# Altium schematic sheet S03-TRANSCEIVER.SchDoc
size B; SheetNumber: 4; SheetTotal: 4; BLOCK-TITLE: BLUETOOTH RADIO TRANSCEIVER; BLOCK-SIZE: B; BLOCK-PROJECT: MULTIMOD RADIO MODULE; BLOCK-REVISION: 1; BLOCK-ORGANIZATION: UNIVERSITY OF FLORIDA; BLOCK-DESIGNER: MEHRON TALEBI; BLOCK-IDENTIFIER: SUMMER 2023; BLOCK-REVIEWER: MIKE STAPLETON
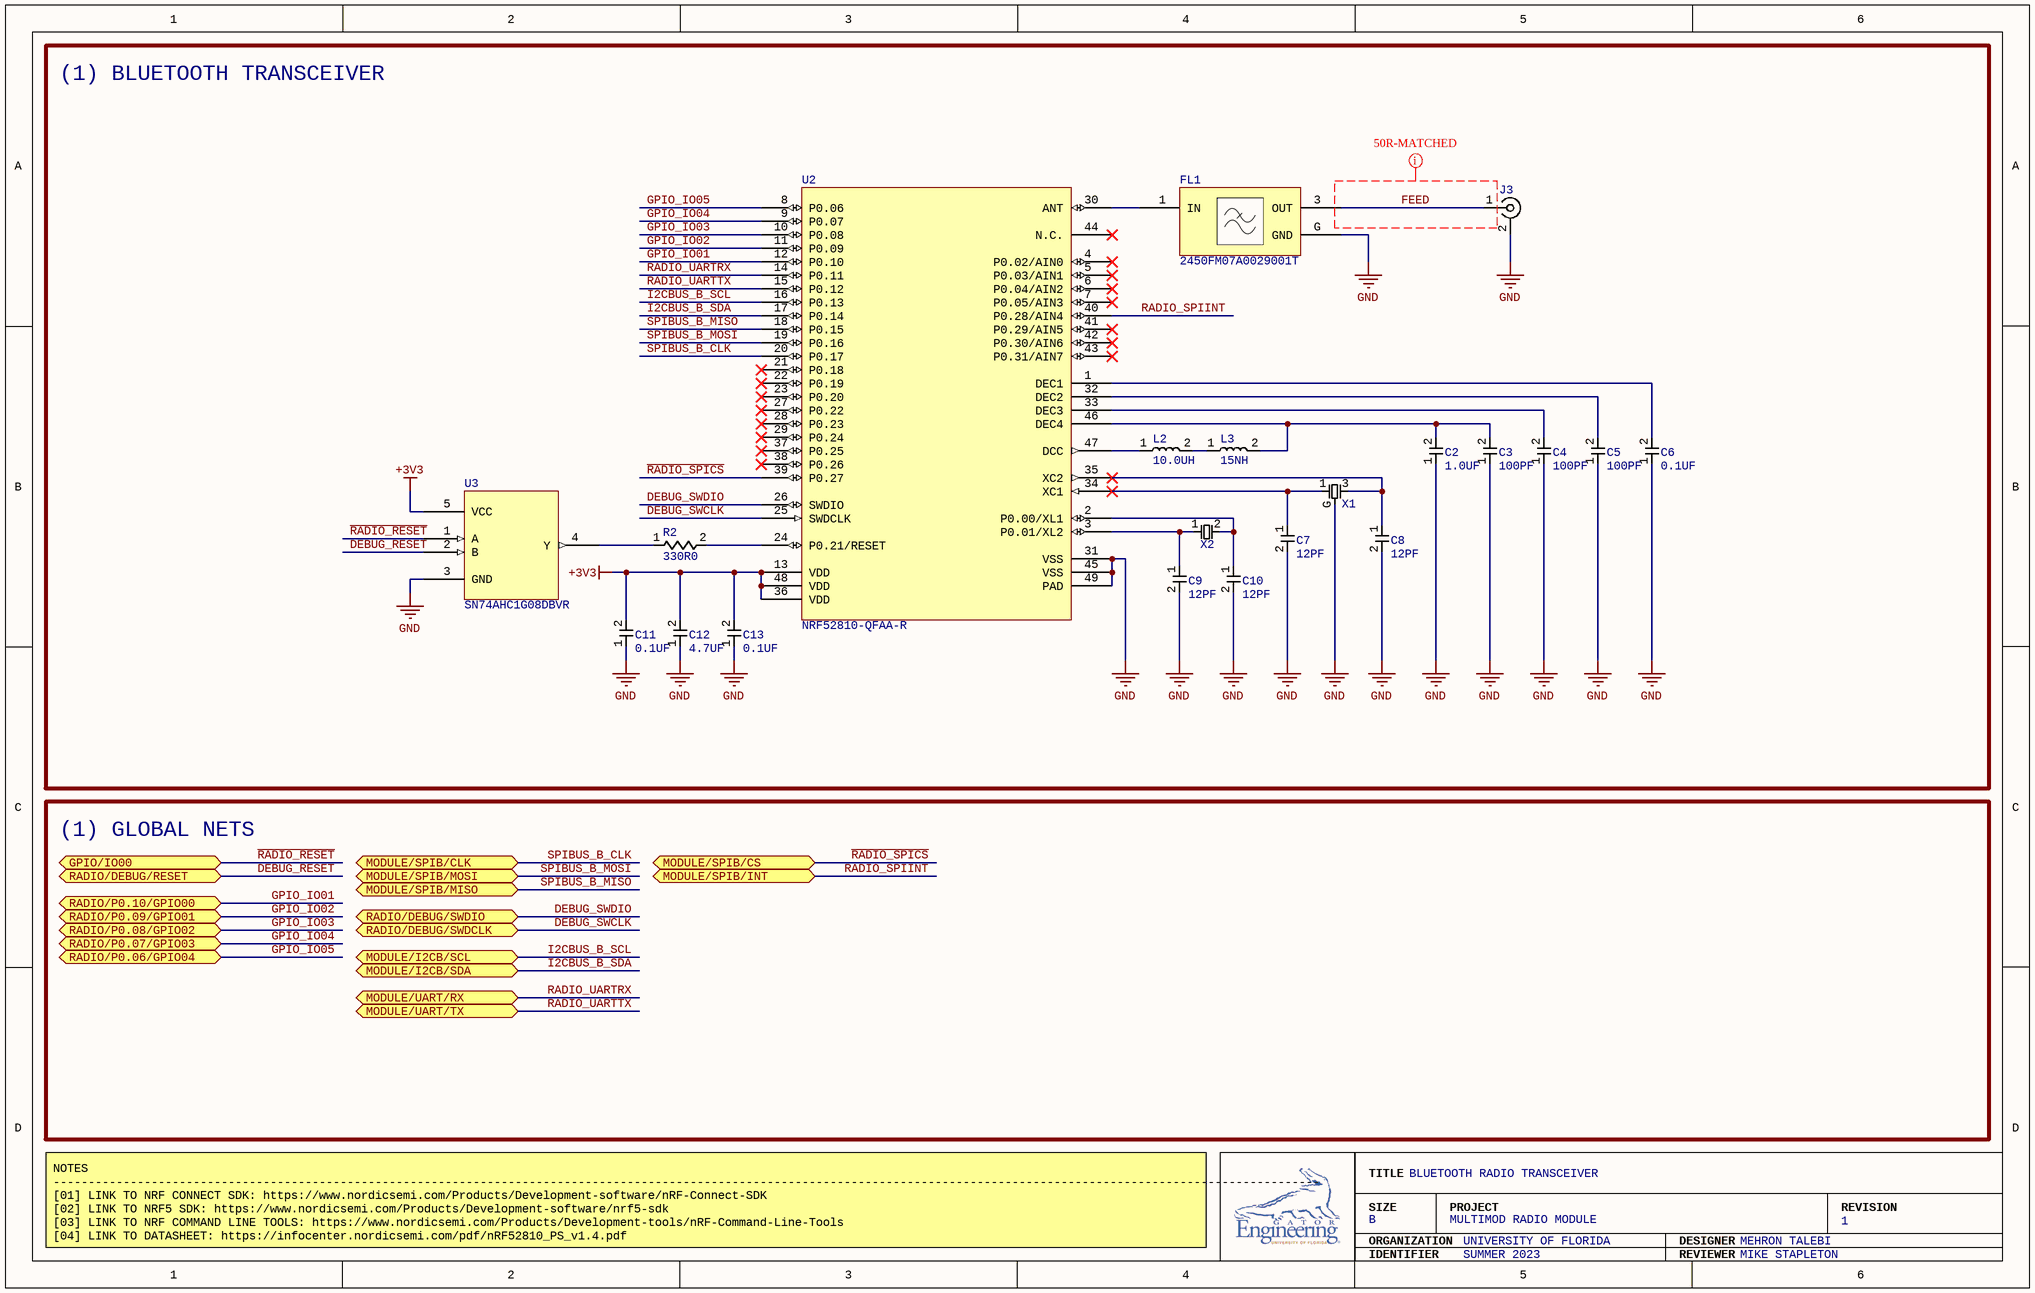
[diagram p0: S03-TRANSCEIVER.SchDoc]

## Parts
C2  1.0UF  [GCM188R71E105KA64D]
C3  100PF  [GCM1555C1H101JA16D]
C4  100PF  [GCM1555C1H101JA16D]
C5  100PF  [GCM1555C1H101JA16D]
C6  0.1UF  [GRM155R71H104KE14D]
C7  12PF  [GJM1555C1H120GB01D]
C8  12PF  [GJM1555C1H120GB01D]
C9  12PF  [GJM1555C1H120GB01D]
C10  12PF  [GJM1555C1H120GB01D]
C11  0.1UF  [GRM155R71H104KE14D]
C12  4.7UF  [GRM188R61E475KE11D]
C13  0.1UF  [GRM155R71H104KE14D]
FL1  2450FM07A0029001T  [2450FM07A0029001T]
J3  2337019-1  [2337019-1]  (value not drawn)
L2  10.0UH  [LQM18FN100M00D]
L3  15NH  [0402HS-150EKTS]
R2  330R0  [RC0805FR-7W330RL]
U2  NRF52810-QFAA-R  [NRF52810-QFAA-R]
U3  SN74AHC1G08DBVR  [SN74AHC1G08DBVR]
X1  32.0000MHZ  [ECS-320-8-37CKM]  (value not drawn)
X2  32.7680KHZ  [ECS-327-9-34QS-TR]  (value not drawn)

## Blocks framed on the sheet
(1) BLUETOOTH TRANSCEIVER: C2-C13 FL1 J3 L2 L3 R2 U2 U3 X1 X2

## Ports
GPIO/IO00 (bidir), MODULE/I2CB/SCL (bidir), MODULE/I2CB/SDA (bidir), MODULE/SPIB/CLK (bidir), MODULE/SPIB/CS (bidir), MODULE/SPIB/INT (bidir), MODULE/SPIB/MISO (bidir), MODULE/SPIB/MOSI (bidir), MODULE/UART/RX (bidir), MODULE/UART/TX (bidir), RADIO/DEBUG/RESET (bidir), RADIO/DEBUG/SWDCLK (bidir), RADIO/DEBUG/SWDIO (bidir), RADIO/P0.06/GPIO04 (bidir), RADIO/P0.07/GPIO03 (bidir), RADIO/P0.08/GPIO02 (bidir), RADIO/P0.09/GPIO01 (bidir), RADIO/P0.10/GPIO00 (bidir)

## Nets
+3V3: C11.2 C12.2 C13.2 U2.13(VDD) U2.36(VDD) U2.48(VDD) U3.5(VCC)
GND: C2.1 C3.1 C4.1 C5.1 C6.1 C7.2 C8.2 C9.2 C10.2 C11.1 C12.1 C13.1 FL1.G(GND) J3.2(GND) U2.31(VSS) U2.45(VSS) U2.49(PAD) U3.3(GND) X1.G
~{DEBUG_RESET}: U3.2(B) ; port RADIO/DEBUG/RESET
~{RADIO_RESET}: U3.1(A) ; port GPIO/IO00
~{RADIO_SPICS}: U2.39(P0.27) ; port MODULE/SPIB/CS
DEBUG_SWCLK: U2.25(SWDCLK) ; port RADIO/DEBUG/SWDCLK
DEBUG_SWDIO: U2.26(SWDIO) ; port RADIO/DEBUG/SWDIO
FEED: FL1.3(OUT) J3.1(SIG)
GPIO_IO01: U2.12(P0.10) ; port RADIO/P0.10/GPIO00
GPIO_IO02: U2.11(P0.09) ; port RADIO/P0.09/GPIO01
GPIO_IO03: U2.10(P0.08) ; port RADIO/P0.08/GPIO02
GPIO_IO04: U2.9(P0.07) ; port RADIO/P0.07/GPIO03
GPIO_IO05: U2.8(P0.06) ; port RADIO/P0.06/GPIO04
I2CBUS_B_SCL: U2.16(P0.13) ; port MODULE/I2CB/SCL
I2CBUS_B_SDA: U2.17(P0.14) ; port MODULE/I2CB/SDA
RADIO_SPIINT: U2.40(P0.28/AIN4) ; port MODULE/SPIB/INT
RADIO_UARTRX: U2.14(P0.11) ; port MODULE/UART/RX
RADIO_UARTTX: U2.15(P0.12) ; port MODULE/UART/TX
SPIBUS_B_CLK: U2.20(P0.17) ; port MODULE/SPIB/CLK
SPIBUS_B_MISO: U2.18(P0.15) ; port MODULE/SPIB/MISO
SPIBUS_B_MOSI: U2.19(P0.16) ; port MODULE/SPIB/MOSI
NetC2_2: C2.2 C3.2 L3.2 U2.46(DEC4)
NetC4_2: C4.2 U2.33(DEC3)
NetC5_2: C5.2 U2.32(DEC2)
NetC6_2: C6.2 U2.1(DEC1)
NetC7_1: C7.1 U2.34(XC1) X1.1
NetC8_1: C8.1 U2.35(XC2) X1.3
NetC9_1: C9.1 U2.3(P0.01/XL2) X2.1
NetC10_1: C10.1 U2.2(P0.00/XL1) X2.2
NetFL1_1: FL1.1(IN) U2.30(ANT)
NetL2_1: L2.1 U2.47(DCC)
NetL2_2: L2.2 L3.1
NetR2_1: R2.1 U3.4(Y)
NetR2_2: R2.2 U2.24(P0.21/RESET)

Not connected (* = marked no-connect by the designer): U2 4(P0.02/AIN0)* 5(P0.03/AIN1)* 6(P0.04/AIN2)* 7(P0.05/AIN3)* 21(P0.18)* 22(P0.19)* 23(P0.20)* 27(P0.22)* 28(P0.23)* 29(P0.24)* 37(P0.25)* 38(P0.26)* 41(P0.29/AIN5)* 42(P0.30/AIN6)* 43(P0.31/AIN7)* 44(N.C.)*

## Layout directives
net class 50R-MATCHED: FEED

## Notes on the sheet
- (1) GLOBAL NETS
- NOTES
  -------------------------------------------------------------------------------------------------------------------------------------------------------------------------------------
  [01] LINK TO NRF CONNECT SDK: https://www.nordicsemi.com/Products/Development-software/nRF-Connect-SDK
  [02] LINK TO NRF5 SDK: https://www.nordicsemi.com/Products/Development-software/nrf5-sdk
  [03] LINK TO NRF COMMAND LINE TOOLS: https://www.nordicsemi.com/Products/Development-tools/nRF-Command-Line-Tools
  [04] LINK TO DATASHEET: https://infocenter.nordicsemi.com/pdf/nRF52810_PS_v1.4.pdf
- TITLE
- SIZE
- ORGANIZATION
- PROJECT
- DESIGNER
- REVISION
- IDENTIFIER
- REVIEWER

## Library data of the parts
C2 = GCM188R71E105KA64D: CAP CER 1UF 25V X7R 0603; Capacitance: 1 µF; Tolerance: ±10%; Voltage - Rated: 25V; Temperature Coefficient: X7R; Operating Temperature: -55°C ~ 125°C; Ratings: AEC-Q200; Applications: Automotive; Mounting Type: Surface Mount, MLCC; Package / Case: 0603 (1608 Metric); Size / Dimension: 0.063" L x 0.031" W (1.60mm x 0.80mm); Thickness (Max): 0.035" (0.90mm); Supplier 1: Arrow Electronics; Supplier Part Number 1: GCM188R71E105KA64D
C3-C5 = GCM1555C1H101JA16D: CAP CER 100PF 50V C0G/NP0 0402; Tolerance: ±5%; Temperature Coefficient: C0G, NP0; Capacitance: 100 pF; Voltage - Rated: 50V; Operating Temperature: -55°C ~ 125°C; Ratings: AEC-Q200; Applications: Automotive; Mounting Type: Surface Mount, MLCC; Package / Case: 0402 (1005 Metric); Size / Dimension: 0.039" L x 0.020" W (1.00mm x 0.50mm); Thickness (Max): 0.022" (0.55mm); Supplier 1: Arrow Electronics; Supplier Part Number 1: GCM1555C1H101JA16D
C6 C11 C13 = GRM155R71H104KE14D: CAP CER 0.1UF 50V X7R 0402; Capacitance: 0.1 µF; Tolerance: ±10%; Voltage - Rated: 50V; Temperature Coefficient: X7R; Operating Temperature: -55°C ~ 125°C; Applications: General Purpose; Mounting Type: Surface Mount, MLCC; Package / Case: 0402 (1005 Metric); Size / Dimension: 0.039" L x 0.020" W (1.00mm x 0.50mm); Thickness (Max): 0.022" (0.55mm); Supplier 1: Arrow Electronics; Supplier Part Number 1: GRM155R71H104KE14D
C7-C10 = GJM1555C1H120GB01D: CAP CER 12PF 50V C0G/NP0 0402; Tolerance: ±2%; Temperature Coefficient: C0G, NP0; Capacitance: 12 pF; Voltage - Rated: 50V; Operating Temperature: -55°C ~ 125°C; Features: High Q, Low Loss; Applications: RF, Microwave, High Frequency; Mounting Type: Surface Mount, MLCC; Package / Case: 0402 (1005 Metric)c; Size / Dimension: 0.039" L x 0.020" W (1.00mm x 0.50mm); Thickness (Max): 0.022" (0.55mm); Supplier 1: Arrow Electronics; Supplier Part Number 1: GJM1555C1H120GB01D
C12 = GRM188R61E475KE11D: CAP CER 4.7UF 25V X5R 0603; Capacitance: 4.7 µF; Tolerance: ±10%; Voltage - Rated: 25V; Temperature Coefficient: X5R; Operating Temperature: -55°C ~ 85°C; Applications: General Purpose; Mounting Type: Surface Mount, MLCCc; Package / Case: 0603 (1608 Metric); Size / Dimension: 0.063" L x 0.031" W (1.60mm x 0.80mm); Thickness (Max): 0.037" (0.95mm); Supplier 1: Arrow Electronics; Supplier Part Number 1: GRM188R61E475KE11D
FL1 = 2450FM07A0029001T: RF FILTR LO PASS 2.4-2.5GHZ 0402; Frequency: 2.4GHz ~ 2.5GHz; Bandwidth: 100MHz; Filter Type: Low Pass; Insertion Loss: 0.8dB; Mounting Type: Surface Mount; Package / Case: 0402 (1005 Metric); Size / Dimension: 0.039" L x 0.020" W (1.00mm x 0.50mm); Height (Max): 0.016" (0.40mm); Supplier 1: Mouser; Supplier Part Number 1: 609-2450FM07A0029T
J3 = 2337019-1: UMCC MICRO-COAX RECEPTACLE, GEN; Connector Style: U.FL (UMCC); Connector Type: Receptacle, Male Pin; Contact Termination: Solder; Impedance: 50Ohm; Frequency - Max: 6 GHz; Number of Ports: 1; Center Contact Material: Copper Alloy; Center Contact Plating: Gold; Dielectric Material: Thermoplastic; Shield Termination: Solder; Mounting Type: Surface Mount; Body Material: Copper Alloy; Operating Temperature: -40°C ~ 85°C; Supplier 1: Arrow Electronics; Supplier Part Number 1: 2337019-1
L2 = LQM18FN100M00D: FIXED IND 10UH 50MA 1.17 OHM SMD; Type: Multilayer; Material - Core: Ferrite; Inductance: 10 µH; Tolerance: ±20%; Shielding: Shielded; DC Resistance (DCR): 1.17Ohm Max; Frequency - Self Resonant: 30MHz; Inductance Frequency - Test: 1 MHz; Current Rating (Amps): 50 mA; Current - Saturation (Isat): 50mA; Operating Temperature: -55°C ~ 125°C; Mounting Type: Surface Mount; Package / Case: 0603 (1608 Metric); Size / Dimension: 0.063" L x 0.031" W (1.60mm x 0.80mm); Height - Seated (Max): 0.035" (0.90mm); Supplier 1: Arrow Electronics; Supplier Part Number 1: LQM18FN100M00D
L3 = 0402HS-150EKTS: FIXED IND 15NH 560MA 172MOHM SMD; Type: Drum Core, Wirewound; Material - Core: Ceramic; Tolerance: ±10%; Shielding: Unshielded; Q @ Freq: 24 @ 250MHz; Frequency - Self Resonant: 3.28GHz; Inductance Frequency - Test: 250 MHz; Inductance: 15 nH; Current Rating (Amps): 560 mA; DC Resistance (DCR): 172mOhm; Operating Temperature: -40°C ~ 125°C; Mounting Type: Surface Mount; Package / Case: 0402 (1005 Metric); Size / Dimension: 0.050" L x 0.030" W (1.27mm x 0.76mm); Height - Seated (Max): 0.024" (0.60mm); Supplier 1: Digi-Key; Supplier Part Number 1: 2035-0402HS-150EKTSCT-ND
R2 = RC0805FR-7W330RL: RES 330 OHM 1% 1/4W 0805; Resistance: 330 Ohms; Power (Watts): 0.25W, 1/4W; Temperature Coefficient: ±100ppm/°C; Tolerance: ±1%; Composition: Thick Film; Features: Moisture Resistant; Operating Temperature: -55°C ~ 155°C; Supplier Device Package: 0805; Size / Dimension: 0.079" L x 0.049" W (2.00mm x 1.25mm); Height - Seated (Max): 0.024" (0.60mm); Number of Terminations: 2; Supplier 1: Mouser; Supplier Part Number 1: 603-RC0805FR-7W330RL
U2 = NRF52810-QFAA-R: IC RF TXRX+MCU BLUETOOTH 48VFQFN; Protocol: Bluetooth v5.0; Frequency: 2.4GHz; Data Rate (Max): 2Mbps; Power - Output: 4dBm; Sensitivity: -96dBm; Serial Interfaces: I²C, UART; GPIO: 32; Voltage - Supply: 1.7V ~ 3.6V; Current - Receiving: 4.6mA; Current - Transmitting: 4.6mA ~ 25mA; Type: TxRx + MCU; RF Family/Standard: Bluetooth; Operating Temperature: -40°C ~ 85°C; Mounting Type: Surface Mount; Package / Case: 48-VFQFN Exposed Pad; Supplier Device Package: 48-QFN (6x6); Supplier 1: Newark; Supplier Part Number 1: 50AC6443
U3 = SN74AHC1G08DBVR: IC GATE AND 1CH 2-INP SOT23-5; Logic Type: AND Gate; Number of Circuits: 1; Number of Inputs: 2; Voltage - Supply: 2V ~ 5.5V; Current - Quiescent (Max): 1 µA; Current - Output High, Low: 8mA, 8mA; Input Logic Level - Low: 0.5V ~ 1.65V; Input Logic Level - High: 1.5V ~ 3.85V; Max Propagation Delay @ V, Max CL: 7.9ns @ 5V, 50pF; Operating Temperature: -55°C ~ 125°C; Mounting Type: Surface Mount; Supplier Device Package: SOT-23-5; Package / Case: SC-74A, SOT-753; Supplier 1: Digi-Key; Supplier Part Number 1: 296-1091-1-ND
X1 = ECS-320-8-37CKM: CRYSTAL 32.0000MHZ 8PF SMD; Frequency: 32 MHz; Frequency Stability: ±10ppm; ESR (Equivalent Series Resistance): 60 Ohms; Operating Mode: Fundamental; Type: MHz Crystal; Frequency Tolerance: ±10ppm; Load Capacitance: 8pF; Operating Temperature: -20°C ~ 70°C; Mounting Type: Surface Mount; Package / Case: 4-SMD, No Lead; Size / Dimension: 0.079" L x 0.063" W (2.00mm x 1.60mm); Height - Seated (Max): 0.022" (0.55mm); Supplier 1: Arrow Electronics; Supplier Part Number 1: ECS-320-8-37CKM
X2 = ECS-327-9-34QS-TR: CRYSTAL 32.7680KHZ 9PF SMD; Frequency: 32.768 kHz; Frequency Tolerance: ±20ppm; ESR (Equivalent Series Resistance): 70 kOhms; Operating Mode: Fundamental; Type: kHz Crystal (Tuning Fork); Load Capacitance: 9pF; Operating Temperature: -40°C ~ 125°C; Ratings: AEC-Q200; Mounting Type: Surface Mount; Package / Case: 2-SMD, No Lead; Size / Dimension: 0.126" L x 0.059" W (3.20mm x 1.50mm); Height - Seated (Max): 0.035" (0.90mm); Supplier 1: Arrow Electronics; Supplier Part Number 1: ECS-.327-9-34QS-TR